# Altium schematic sheet PROC091F_CAN_INTERFACE.SchDoc: BREAKAWAY_SECTION5
size 431 x 279 mm; Date: Not shown in title block; ApprovedBy: Not shown in title block; CheckedBy: Not shown in title block; Author: Not shown in title block; CompanyName: Not shown in title block; DrawnBy: Antony/Bala; Engineer: Not shown in title block; Organization: Not shown in title block; Address1: Not shown in title block; Address2: Not shown in title block; Address3: Not shown in title block; Address4: Not shown in title block; DocumentNumber: 11; Revision: Use project parameter SCH_Rev; SheetNumber: 11; SheetTotal: 12; PageSetup: Record=PageOptions|CenterHorizontal=True|CenterVertical=True|PrintScale=1.00|XCorrection=1.00|YCorrection=1.00|PrintKind=0|BorderSize=5000000|LeftOffset=0|BottomOffset=0|Orientation=2|PaperLength=1000|PaperWidth=1000|Scale=100|PaperSource=15|PrintQuality=600|MediaType=1|DitherType=10|PaperKind=Letter|PrintScaleMode=1; CurrentTime: Not shown in title block; CurrentDate: Not shown in title block; Time: Not shown in title block; DocumentFullPathAndName: Not shown in title block; DocumentName: Not shown in title block; ModifiedDate: Not shown in title block; ImagePath: Not shown in title block
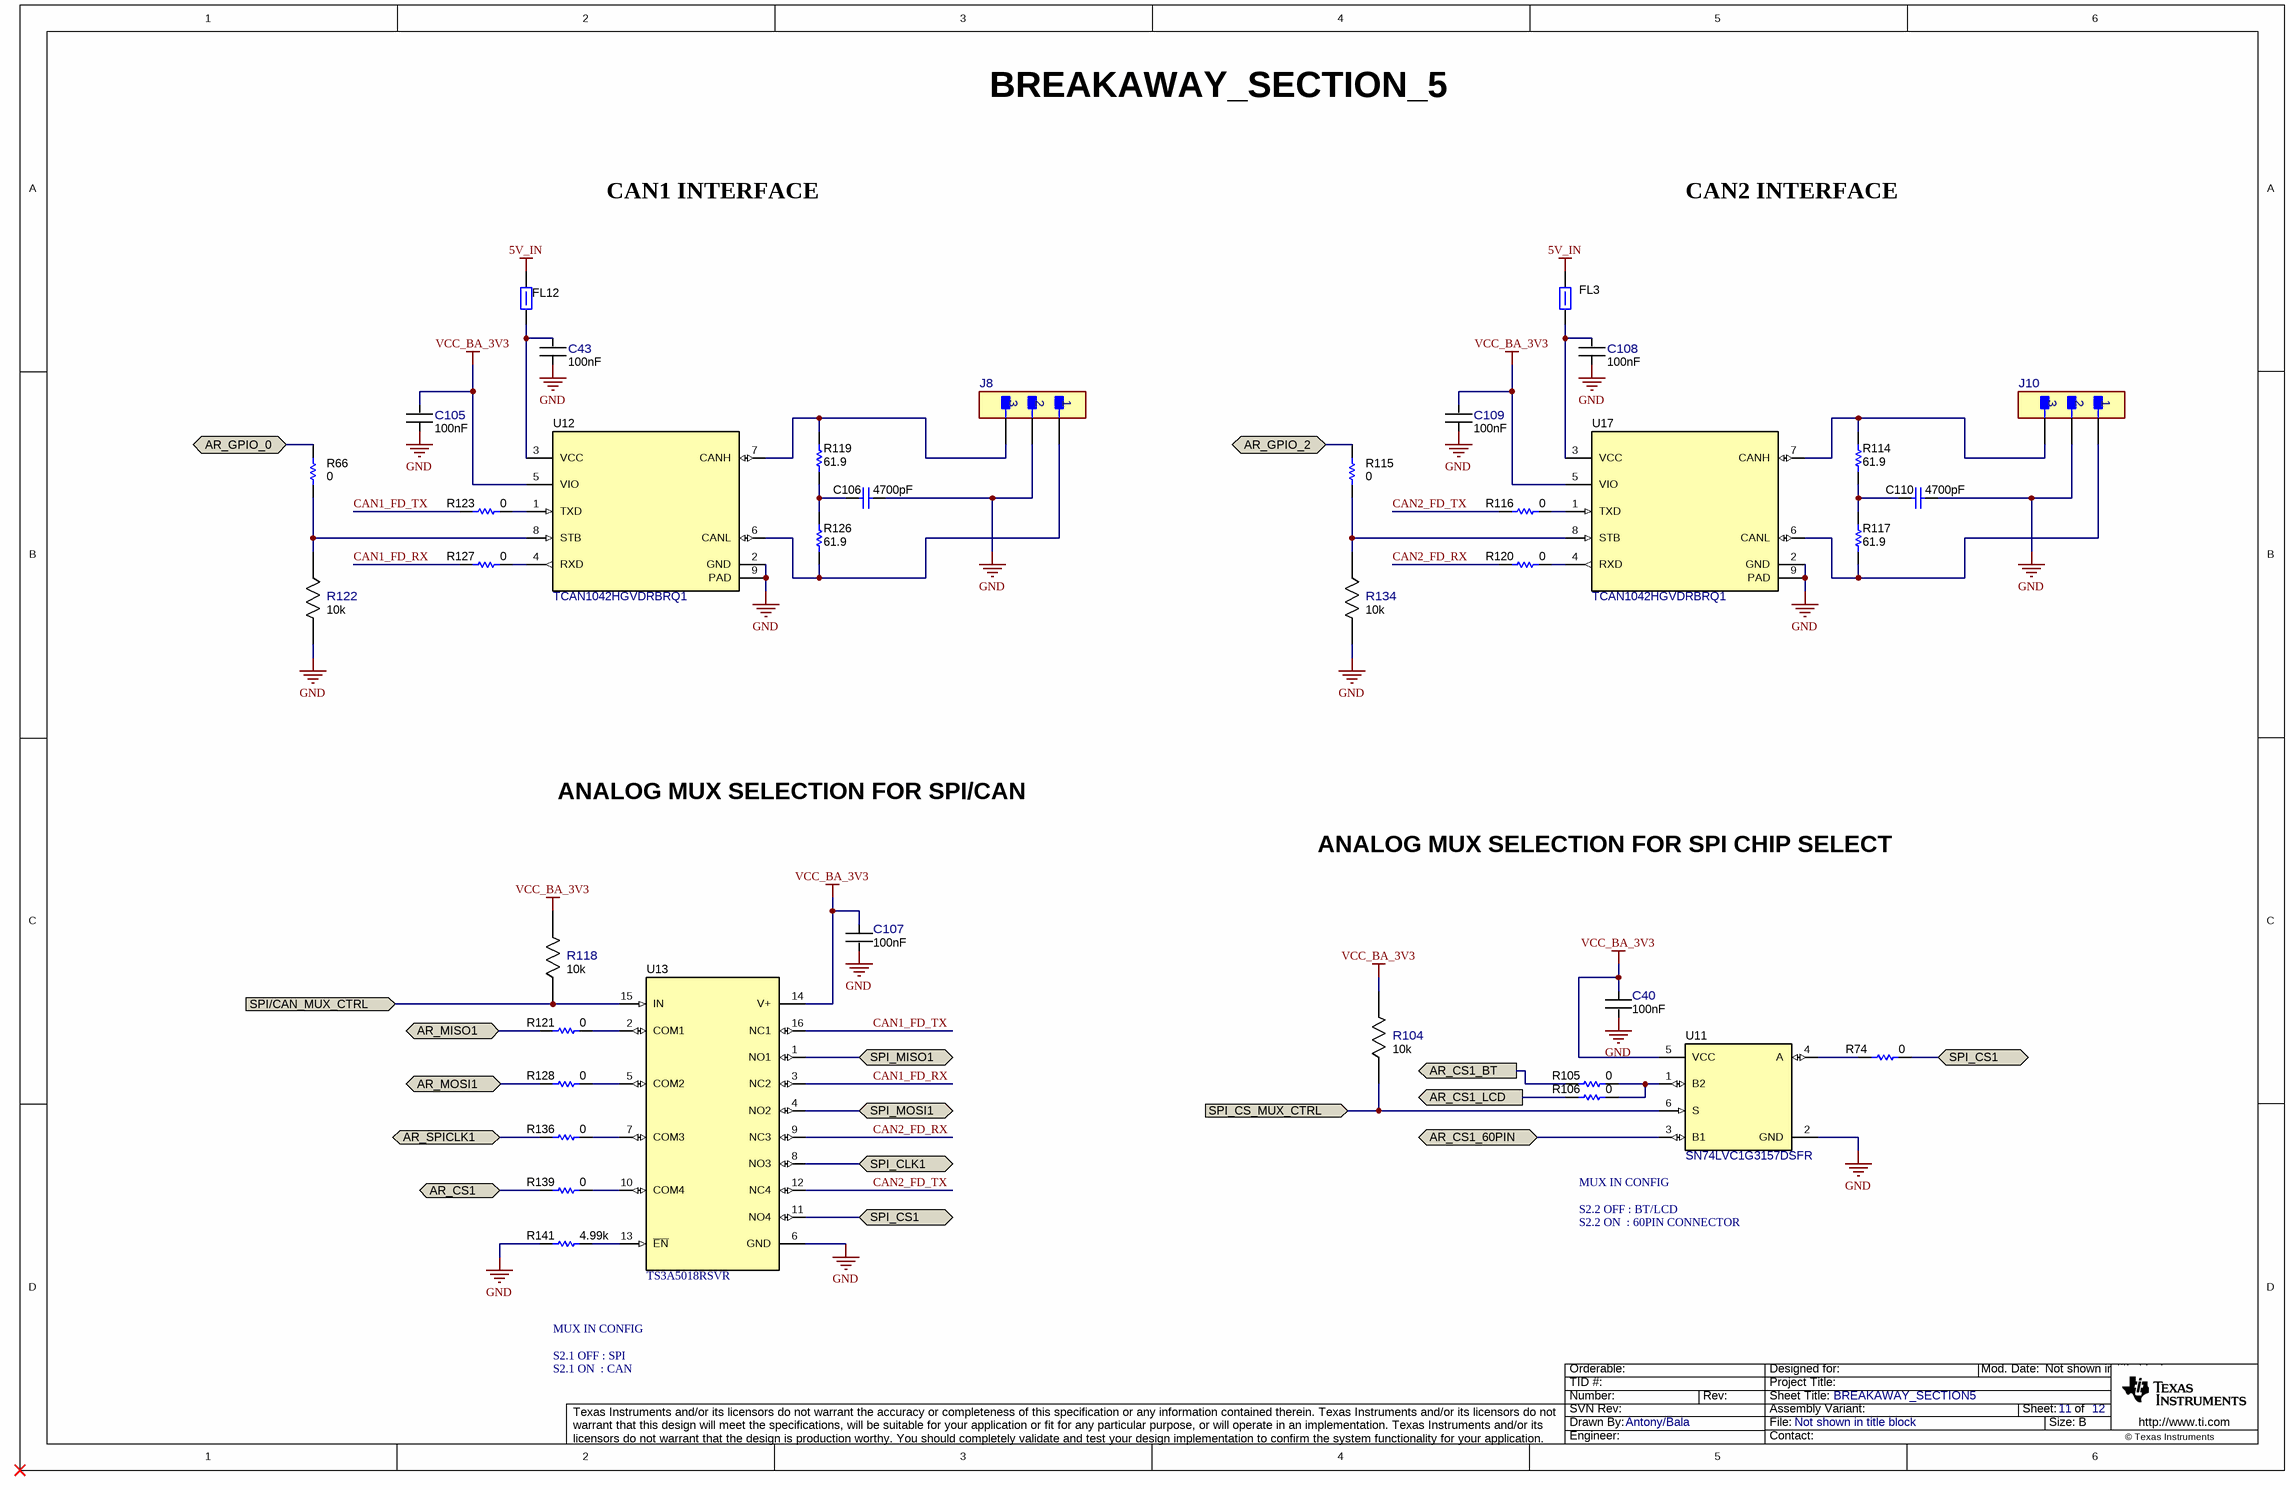
[diagram p0: PROC091F_CAN_INTERFACE.SchDoc]

## Parts
C40  Cap_F: 100nF  [FP-GRM033R6YA104KE14D_0201 (0603 Metric)-IPC_C]  (hidden comment: GRM033R6YA104KE14D)
C43  Cap_F: 100nF  [FP-GRM033R6YA104KE14D_0201 (0603 Metric)-IPC_C]  (hidden comment: GRM033R6YA104KE14D)
C105  Cap_F: 100nF  [FP-GRM033R6YA104KE14D_0201 (0603 Metric)-IPC_C]  (hidden comment: GRM033R6YA104KE14D)
C106  ValueDisplayed: 4700pF  [0402L]  (hidden comment: GRM155R71H472KA01D)
C107  Cap_F: 100nF  [FP-GRM033R6YA104KE14D_0201 (0603 Metric)-IPC_C]  (hidden comment: GRM033R6YA104KE14D)
C108  Cap_F: 100nF  [FP-GRM033R6YA104KE14D_0201 (0603 Metric)-IPC_C]  (hidden comment: GRM033R6YA104KE14D)
C109  Cap_F: 100nF  [FP-GRM033R6YA104KE14D_0201 (0603 Metric)-IPC_C]  (hidden comment: GRM033R6YA104KE14D)
C110  ValueDisplayed: 4700pF  [0402L]  (hidden comment: GRM155R71H472KA01D)
FL3  BLM15PD300SZ1D  [0402L]  (value not drawn)
FL12  BLM15PD300SZ1D  [0402L]  (value not drawn)
J8  M50-3930342  [FP-M50-3930342_HDR3-MFG]  (value not drawn)
J10  M50-3930342  [FP-M50-3930342_HDR3-MFG]  (value not drawn)
R66  Res_ohm: 0  [FP-RC0201JR-070RL_0201 (0603 Metric)-IPC_C]  (hidden comment: RC0201JR-070RL)
R74  Res_ohm: 0  [FP-RC0201JR-070RL_0201 (0603 Metric)-IPC_C]  (hidden comment: RC0201JR-070RL)
R104  Res_ohm: 10k  [FP-RR0306P-103-D_0201-IPC_C]  (hidden comment: RR0306P-103-D)
R105  Res_ohm: 0  [FP-RC0201JR-070RL_0201 (0603 Metric)-IPC_C]  (hidden comment: RC0201JR-070RL)
R106  Res_ohm: 0  [FP-RC0201JR-070RL_0201 (0603 Metric)-IPC_C]  (hidden comment: RC0201JR-070RL)
R114  ValueDisplayed: 61.9  [0402L]  (hidden comment: CRCW040261R9FKED)
R115  Res_ohm: 0  [FP-RC0201JR-070RL_0201 (0603 Metric)-IPC_C]  (hidden comment: RC0201JR-070RL)
R116  Res_ohm: 0  [FP-RC0201JR-070RL_0201 (0603 Metric)-IPC_C]  (hidden comment: RC0201JR-070RL)
R117  ValueDisplayed: 61.9  [0402L]  (hidden comment: CRCW040261R9FKED)
R118  Res_ohm: 10k  [FP-RR0306P-103-D_0201-IPC_C]  (hidden comment: RR0306P-103-D)
R119  ValueDisplayed: 61.9  [0402L]  (hidden comment: CRCW040261R9FKED)
R120  Res_ohm: 0  [FP-RC0201JR-070RL_0201 (0603 Metric)-IPC_C]  (hidden comment: RC0201JR-070RL)
R121  Res_ohm: 0  [FP-RC0201JR-070RL_0201 (0603 Metric)-IPC_C]  (hidden comment: RC0201JR-070RL)
R122  Res_ohm: 10k  [FP-RR0306P-103-D_0201-IPC_C]  (hidden comment: RR0306P-103-D)
R123  Res_ohm: 0  [FP-RC0201JR-070RL_0201 (0603 Metric)-IPC_C]  (hidden comment: RC0201JR-070RL)
R126  ValueDisplayed: 61.9  [0402L]  (hidden comment: CRCW040261R9FKED)
R127  Res_ohm: 0  [FP-RC0201JR-070RL_0201 (0603 Metric)-IPC_C]  (hidden comment: RC0201JR-070RL)
R128  Res_ohm: 0  [FP-RC0201JR-070RL_0201 (0603 Metric)-IPC_C]  (hidden comment: RC0201JR-070RL)
R134  Res_ohm: 10k  [FP-RR0306P-103-D_0201-IPC_C]  (hidden comment: RR0306P-103-D)
R136  Res_ohm: 0  [FP-RC0201JR-070RL_0201 (0603 Metric)-IPC_C]  (hidden comment: RC0201JR-070RL)
R139  Res_ohm: 0  [FP-RC0201JR-070RL_0201 (0603 Metric)-IPC_C]  (hidden comment: RC0201JR-070RL)
R141  value 4.99k  [0201L]  (hidden comment: RC0201FR-074K99L)
U11  SN74LVC1G3157DSFR  [DSF0006A]
U12  TCAN1042HGVDRBRQ1  [DRB0008F]
U13  TS3A5018RSVR  [RSV0016A]
U17  TCAN1042HGVDRBRQ1  [DRB0008F]

## Ports
AR_CS1 (bidir), AR_CS1_60PIN (bidir), AR_CS1_BT (out), AR_CS1_LCD (out), AR_GPIO_0 (bidir), AR_GPIO_2 (bidir), AR_MISO1 (bidir), AR_MOSI1 (bidir), AR_SPICLK1 (bidir), SPI/CAN_MUX_CTRL (in), SPI_CLK1 (bidir), SPI_CS1 (bidir), SPI_CS_MUX_CTRL (in), SPI_MISO1 (bidir), SPI_MOSI1 (bidir)

## Nets
5V_IN: FL3.2 FL12.2
GND: C40.2 C43.1 C105.1 C106.1 C107.2 C108.1 C109.1 C110.1 J8.2 J10.2 R122.2 R134.2 R141.2 U11.2(GND) U12.2(GND) U12.9(PAD) U13.6(GND) U17.2(GND) U17.9(PAD)
VCC_BA_3V3: C40.1 C105.2 C107.1 C109.2 R104.2 R118.2 U11.5(VCC) U12.5(VIO) U13.14(V+) U17.5(VIO)
AR_CS1: R139.2 ; port AR_CS1
AR_CS1_60PIN: U11.3(B1) ; port AR_CS1_60PIN
AR_CS1_BT: R105.2 ; port AR_CS1_BT
AR_CS1_LCD: R106.2 ; port AR_CS1_LCD
AR_GPIO_0: R66.1 ; port AR_GPIO_0
AR_GPIO_2: R115.1 ; port AR_GPIO_2
AR_MISO1: R121.2 ; port AR_MISO1
AR_MOSI1: R128.2 ; port AR_MOSI1
AR_SPICLK1: R136.2 ; port AR_SPICLK1
CAN1_FD_RX: R127.2 U13.3(NC2)
CAN1_FD_TX: R123.2 U13.16(NC1)
CAN2_FD_RX: R120.2 U13.9(NC3)
CAN2_FD_TX: R116.2 U13.12(NC4)
SPI/CAN_MUX_CTRL: R118.1 U13.15(IN) ; port SPI/CAN_MUX_CTRL
SPI_CLK1: U13.8(NO3) ; port SPI_CLK1
SPI_CS1: R74.1 U13.11(NO4) ; port SPI_CS1
SPI_CS_MUX_CTRL: R104.1 U11.6(S) ; port SPI_CS_MUX_CTRL
SPI_MISO1: U13.1(NO1) ; port SPI_MISO1
SPI_MOSI1: U13.4(NO2) ; port SPI_MOSI1
NetC43_2: C43.2 FL12.1 U12.3(VCC)
NetC106_2: C106.2 R119.1 R126.2
NetC108_2: C108.2 FL3.1 U17.3(VCC)
NetC110_2: C110.2 R114.1 R117.2
NetJ8_1: J8.1 R126.1 U12.6(CANL)
NetJ8_3: J8.3 R119.2 U12.7(CANH)
NetJ10_1: J10.1 R117.1 U17.6(CANL)
NetJ10_3: J10.3 R114.2 U17.7(CANH)
NetR66_2: R66.2 R122.1 U12.8(STB)
NetR74_2: R74.2 U11.4(A)
NetR105_1: R105.1 R106.1 U11.1(B2)
NetR115_2: R115.2 R134.1 U17.8(STB)
NetR116_1: R116.1 U17.1(TXD)
NetR120_1: R120.1 U17.4(RXD)
NetR121_1: R121.1 U13.2(COM1)
NetR123_1: R123.1 U12.1(TXD)
NetR127_1: R127.1 U12.4(RXD)
NetR128_1: R128.1 U13.5(COM2)
NetR136_1: R136.1 U13.7(COM3)
NetR139_1: R139.1 U13.10(COM4)
NetR141_1: R141.1 U13.13(~{EN})

## Notes on the sheet
- BREAKAWAY_SECTION_5
- CAN1 INTERFACE
- CAN2 INTERFACE
- ANALOG MUX SELECTION FOR SPI/CAN
- ANALOG MUX SELECTION FOR SPI CHIP SELECT
- (near U11) MUX IN CONFIG
- S2.2 ON  : 60PIN CONNECTOR
- S2.2 OFF : BT/LCD
- MUX IN CONFIG
- S2.1 OFF : SPI
- S2.1 ON  : CAN
- Drawn By:
- SVN Rev:
- Number:
- TID #:
- Orderable:
- Rev:
- Sheet Title:
- File:
- Project Title:
- Designed for:
- Assembly Variant:
- Mod. Date:
- Sheet:
- Size:
- of
- B
- http://www.ti.com
- Texas Instruments and/or its licensors do not warrant the accuracy or completeness of this specification or any information contained therein. Texas Instruments and/or its licensors do not warrant that this design will meet the specifications, will be suitable for your application or fit for any particular purpose, or will operate in an implementation. Texas Instruments and/or its licensors do not warrant that the design is production worthy. You should completely validate and test your design implementation to confirm the system functionality for your application.
- Engineer:
- Contact:
- © Texas Instruments

## Library data of the parts
C40 C43 C105 C107-C109 = CMP-0086440-1: Cap Ceramic 0.1uF 35V X5R 10% Pad SMD 0201 85C T/R; Manufacturer: Murata Electronics North America; AEC Qualified: No; SizeZ_mm: 0.33mm; Symbol Name: SYM-GRM033R6YA104KE14D; TempCo: 15%; RoHS: TRUE; ComponentLink1Description: Datasheet; ComponentLink1URL: https://search.murata.co.jp/Ceramy/image/img/A01X/G101/ENG/GRM033R6YA104KE14-01.pdf; PackageReference: 0201 (0603 Metric); PartNumber: GRM033R6YA104KE14D; Tolerance_%: 10%; VDC_V: 35V
C106 C110 = CMP-0006692-2: CAP, CERM, 4700 pF, 50 V, +/- 10%, X7R, 0402; Manufacturer: MuRata; TaMin_C: -55°C; Polarized: N; SizeAreaWB_mm2: 3; Value1: Unknown; U/M: EA; Value: 4700pF; TaMax_C: 125°C; SizeZ_mm: 0.6; SizeX_mm: 1; SizeY_mm: 0.5; Cap_Case: 0402; Value2: 50V; Cap_F: 4.7nF; AEC Category: Q200; Supplier Part Number 2: 14T3289; Publisher: Texas Instruments; Supplier 2: Newark; Supplier Part Number 3: 81-GRM155R71H472KA01; TempCo: X7R; Supplier 3: Mouser; Published: 2008-06-19; RoHS: Y; MountType: SMT; Supplier 1: Digi-Key; PackageReference: 0402; Tolerance_%: 10%; SizeArea_mm2: 0.5; CompType: Capacitor; LatestRevisionDate: 2017-03-09; PartNumber: GRM155R71H472KA01D; AEC Qualified: ?; VDC_V: 50V; ComponentLink1Description: Datasheet link; Supplier Part Number 1: 490-1308-1-ND; Technology: Ceramic; ComponentLink1URL: http://search.murata.co.jp/Ceramy/PnsearchViewAction.do?HnOFG=ON&HnNFG=ON&SEL_CNT=50&sLang=en&sKey=GRM155R71H472KA01D&x=9&y=9&search=startwith
FL3 FL12 = CMP-0078934-1: Inductor, Ferrite Bead, Ferrite, 2.2 A, 0.035 ohm, AEC-Q200 Grade 1, SMD; Manufacturer: MuRata; AEC Category: Q200; AEC Grade: 1; AEC Qualified: Y; DCR_ohm: 0.035; Imax_A: 2.2A; SizeArea_mm2: 0.5; SizeAreaWB_mm2: 3; SizeZ_mm: 0.6; RoHS: Y; ComponentLink1Description: Datasheet link; ComponentLink1URL: https://www.murata.com/en-us/products/productdata/8796748677150/QNFA9118.pdf; CompType: Inductor; LatestRevisionDate: 2017-12-07; Material: Ferrite; MountType: SMT; PackageReference: 0402; PartNumber: BLM15PD300SZ1D; Published: 2008-06-26; Publisher: Texas Instruments; SizeX_mm: 1; SizeY_mm: 0.5; Supplier 1: Digi-Key; Supplier 2: Mouser; Supplier Part Number 1: 490-16506-1-ND; Supplier Part Number 2: 81-BLM15PD300SZ1D; Technology: Ferrite Bead; Value1: 0.035 ohm; Value2: 2.2A
J8 J10 = CMP-0087785-1: CONN HEADER R/A 3POS 1.27MM; Manufacturer: Harwin; Row_Count: 1; Current_A: 1A; ContactFinish: Gold,Nickel; PinCount: 3; ComponentLink1URL: https://cdn.harwin.com/pdfs/M50-393.pdf; RoHS: TRUE; PackageReference: HDR3; Symbol Name: SYM-M50-3930342; ComponentLink1Description: Datasheet; PartNumber: M50-3930342
R66 R74 R105 R106 R115 R116 R120 R121 R123 R127 R128 R136 R139 = CMP-0086442-2: RES SMD 0 OHM JUMPER 1/20W 0201; Manufacturer: Yageo; AEC Qualified: No; Power_W: 50mW; SizeZ_mm: 0.26mm; TempCo: 200ppm/°C; Tolerance_%: 5%; VDC_V: 25V; RoHS: TRUE; ComponentLink1Description: Datasheet; ComponentLink1URL: http://www.yageo.com/documents/recent/PYu-RC_Group_51_RoHS_L_10.pdf; PackageReference: 0201 (0603 Metric); PartNumber: RC0201JR-070RL; Technology: Thick Film
R104 R118 R122 R134 = CMP-0088002-1: 10 kOhms ±0.5% 0.05W, 1/20W Chip Resistor 0201 (0603 Metric)  Thin Film; Manufacturer: Susumu; AEC Qualified: No; Power_W: 50mW; SizeZ_mm: 0.26mm; Symbol Name: SYM-RR0306P-103-D; TempCo: 25ppm/°C; VDC_V: 15V; RoHS: TRUE; ComponentLink1Description: Datasheet; ComponentLink1URL: https://www.susumu.co.jp/common/pdf/n_catalog_partition05_en.pdf; PackageReference: 0201; PartNumber: RR0306P-103-D; Technology: Thin Film; Tolerance_%: 0.5%
R114 R117 R119 R126 = CMP-0026491-2: RES, 61.9, 1%, 0.063 W, AEC-Q200 Grade 0, 0402; Manufacturer: Vishay-Dale; Power_W: 63mW; TempCo: 100 ppm/C; Value_Code: 61R9; Value: 61.9; EIA_Code: E96; SizeX_mm: 1; SizeY_mm: 0.5; SizeZ_mm: 0.6; Value2: 0.063W; AEC Qualified: Y; VDC_V: 50V; AEC Category: Q200; AEC Grade: 0; ComponentLink1URL: http://www.vishay.com/docs/20035/dcrcwe3.pdf; Supplier Part Number 2: 52K7198; Supplier 2: Newark; Supplier Part Number 3: 71-CRCW0402-61.9-E3; Supplier 3: Mouser; RoHS: E; Value1: 1%; MountType: SMT; Supplier 1: Digi-Key; PackageReference: 0402; Tolerance_%: 1%; Res_ohm: 61.9; SizeArea_mm2: 0.5; CompType: Resistor; PartNumber: CRCW040261R9FKED; ComponentLink1Description: Datasheet link; Supplier Part Number 1: 541-61.9LCT-ND; Technology: Thick Film
R141 = CMP-0027745-1: RES, 4.99 k, 1%, 0.05 W, 0201; Manufacturer: Yageo America; AEC Category: Q200; AEC Qualified: N; EIA_Code: E96; Power_W: 50mW; SizeArea_mm2: 0.18; SizeX_mm: 0.6; SizeY_mm: 0.3; SizeZ_mm: 0.26; TempCo: 200 ppm/C; U/M: EA; Value2: 0.05W; Value_Code: 4k99; VDC_V: 25V; RoHS: Y; AEC Grade: N/A; ComponentLink1Description: Datasheet link; ComponentLink1URL: http://www.yageo.com/documents/recent/PYu-RC_Group_51_RoHS_L_5.pdf; CompType: Resistor; LatestRevisionDate: 2017-03-09; MountType: SMT; PackageReference: 0201; PartNumber: RC0201FR-074K99L; Published: 2016-10-14; Publisher: Texas Instruments; Res_ohm: 4.99k; Supplier 1: Digi-Key; Supplier 2: Mouser; Supplier Part Number 1: YAG2712CT-ND; Supplier Part Number 2: 603-RC0201FR-074K99L; Technology: Thick Film; Tolerance_%: 1%; Value1: 1%; ValueDisplayed: 4.99k
U11 = CMP-0050992-5: 1-Channel, 2:1 Analog Switch, DSF0006A (X2SON-6); Manufacturer: Texas Instruments; 3-State Output: No; AEC Category: Q200; AEC Qualified: N; Bits(#): 1; CompType: IC; F @ Nom Voltage(Max)(Mhz): 150; ICC @ Nom Voltage(Max)(mA): 0.01; Input Type: CMOS/TTL; Logic: True; Mux Configuration: 1：2; Output Drive (IOL/IOH)(Max)(mA): 32/-32; Output Type: CMOS; Rating: Catalog; Switch Configuration: SPDT; Technology Family: LVC; tpd @ Nom Voltage(Max)(ns): 2,1.2,0.8,0.3; VCC(Max)(V): 5.5; VCC(Min)(V): 1.65; Voltage(Nom)(V): 1.8,2.5,3.3,5; RoHS: Y; Channels(#): 1; ComponentLink1Description: Datasheet Link; ComponentLink1URL: http://www.ti.com/lit/ds/symlink/sn74lvc1g3157.pdf; ComponentLink2Description: Product Folder; ComponentLink2URL: http://www.ti.com/product/sn74lvc1g3157; ComponentLink3Description: Online Datasheet; ComponentLink3URL: http://www.ti.com/product/sn74lvc1g3157/datasheet; Generic Part Number: SN74LVC1G3157; MountType: SMT; Operating Temperature Range: -40 to 85 C; PackageDescription: X2SON-6; PackageReference: DSF0006A; PartNumber: SN74LVC1G3157DSFR; Schmitt Trigger: No
U12 U17 = CMP-0065183-3: Automotive Fault Protected CAN Transceiver With Flexible Data-Rate, DRB0008F (VSON-8); Manufacturer: Texas Instruments; Alternate PartNumber: TCAN1042HGVDRBTQ1; SizeX_mm: 3.0; CompType: IC; SizeZ_mm: 1.0; SizeArea_mm2: 9.0; SizeAreaWB_mm2: 16.0; AEC Category: Q200; AEC Qualified: Y; PackageDescription: VSON-8; PartNumber: TCAN1042HGVDRBRQ1; ComponentLink1URL: http://www.ti.com/lit/ds/symlink/tcan1042hgv-q1.pdf; ComponentLink1Description: Datasheet Link; SizeY_mm: 3.0; PackageReference: DRB0008F; MountType: SMT; Alternate Manufacturer: Texas Instruments; RoHS: Y; ComponentLink2Description: Product Folder; ComponentLink2URL: http://www.ti.com/product/tcan1042hgv-q1; ComponentLink3Description: Online Datasheet; ComponentLink3URL: http://www.ti.com/product/tcan1042hgv-q1/datasheet; Operating Temperature Range: -55 to 125 C; Rating: Automotive
U13 = CMP-0067415-1: 10-Ohm Quad SPDT Analog Switch, RSV0016A (UQFN-16); Alternate Manufacturer: Texas Instruments; SizeAreaWB_mm2: 10.08; U/M: EA; SizeZ_mm: 0.55; SizeX_mm: 1.8; SizeY_mm: 2.6; SizeArea_mm2: 4.68; CompType: IC; ComponentLink1URL: http://www.ti.com/lit/ds/symlink/ts3a5018.pdf; Publisher: Texas Instruments; PackageDescription: UQFN-16; RoHS: Y; Footprint Path 6: C:\AltiumLibraries\Footprints\TI\.PcbLib; MountType: SMT; Manufacturer: Texas Instruments; PackageReference: RSV0016A; LatestRevisionDate: 2017-06-09; PartNumber: TS3A5018RSVR; ComponentLink1Description: Datasheet Link